# Altium schematic sheet master.SchDoc
size A4; SheetNumber: 1; SheetTotal: 8
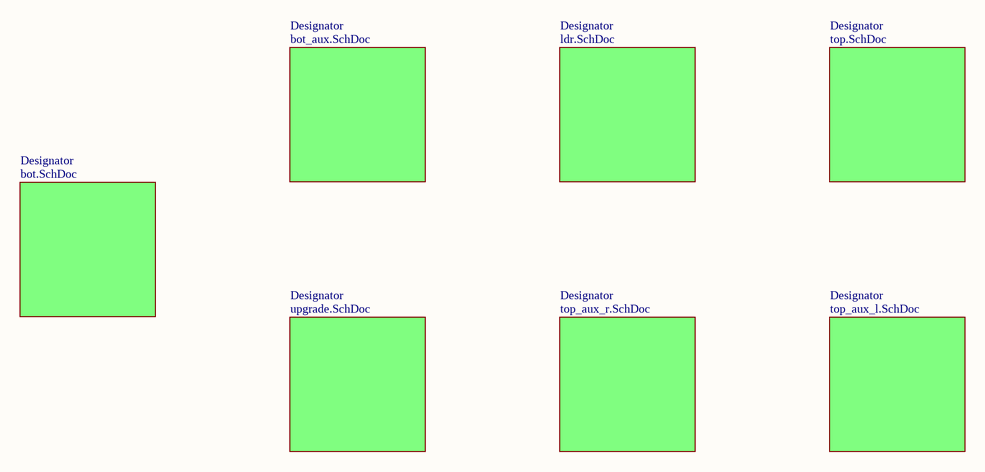
[diagram p0: master.SchDoc]

## Sub-sheets
Designator = bot_aux.SchDoc: no entries
Designator = upgrade.SchDoc: no entries
Designator = top_aux_r.SchDoc: no entries
Designator = ldr.SchDoc: no entries
Designator = top.SchDoc: no entries
Designator = top_aux_l.SchDoc: no entries
Designator = bot.SchDoc: no entries